# EasyEDA schematic SCH_PHOENIX - PCB-2 .json
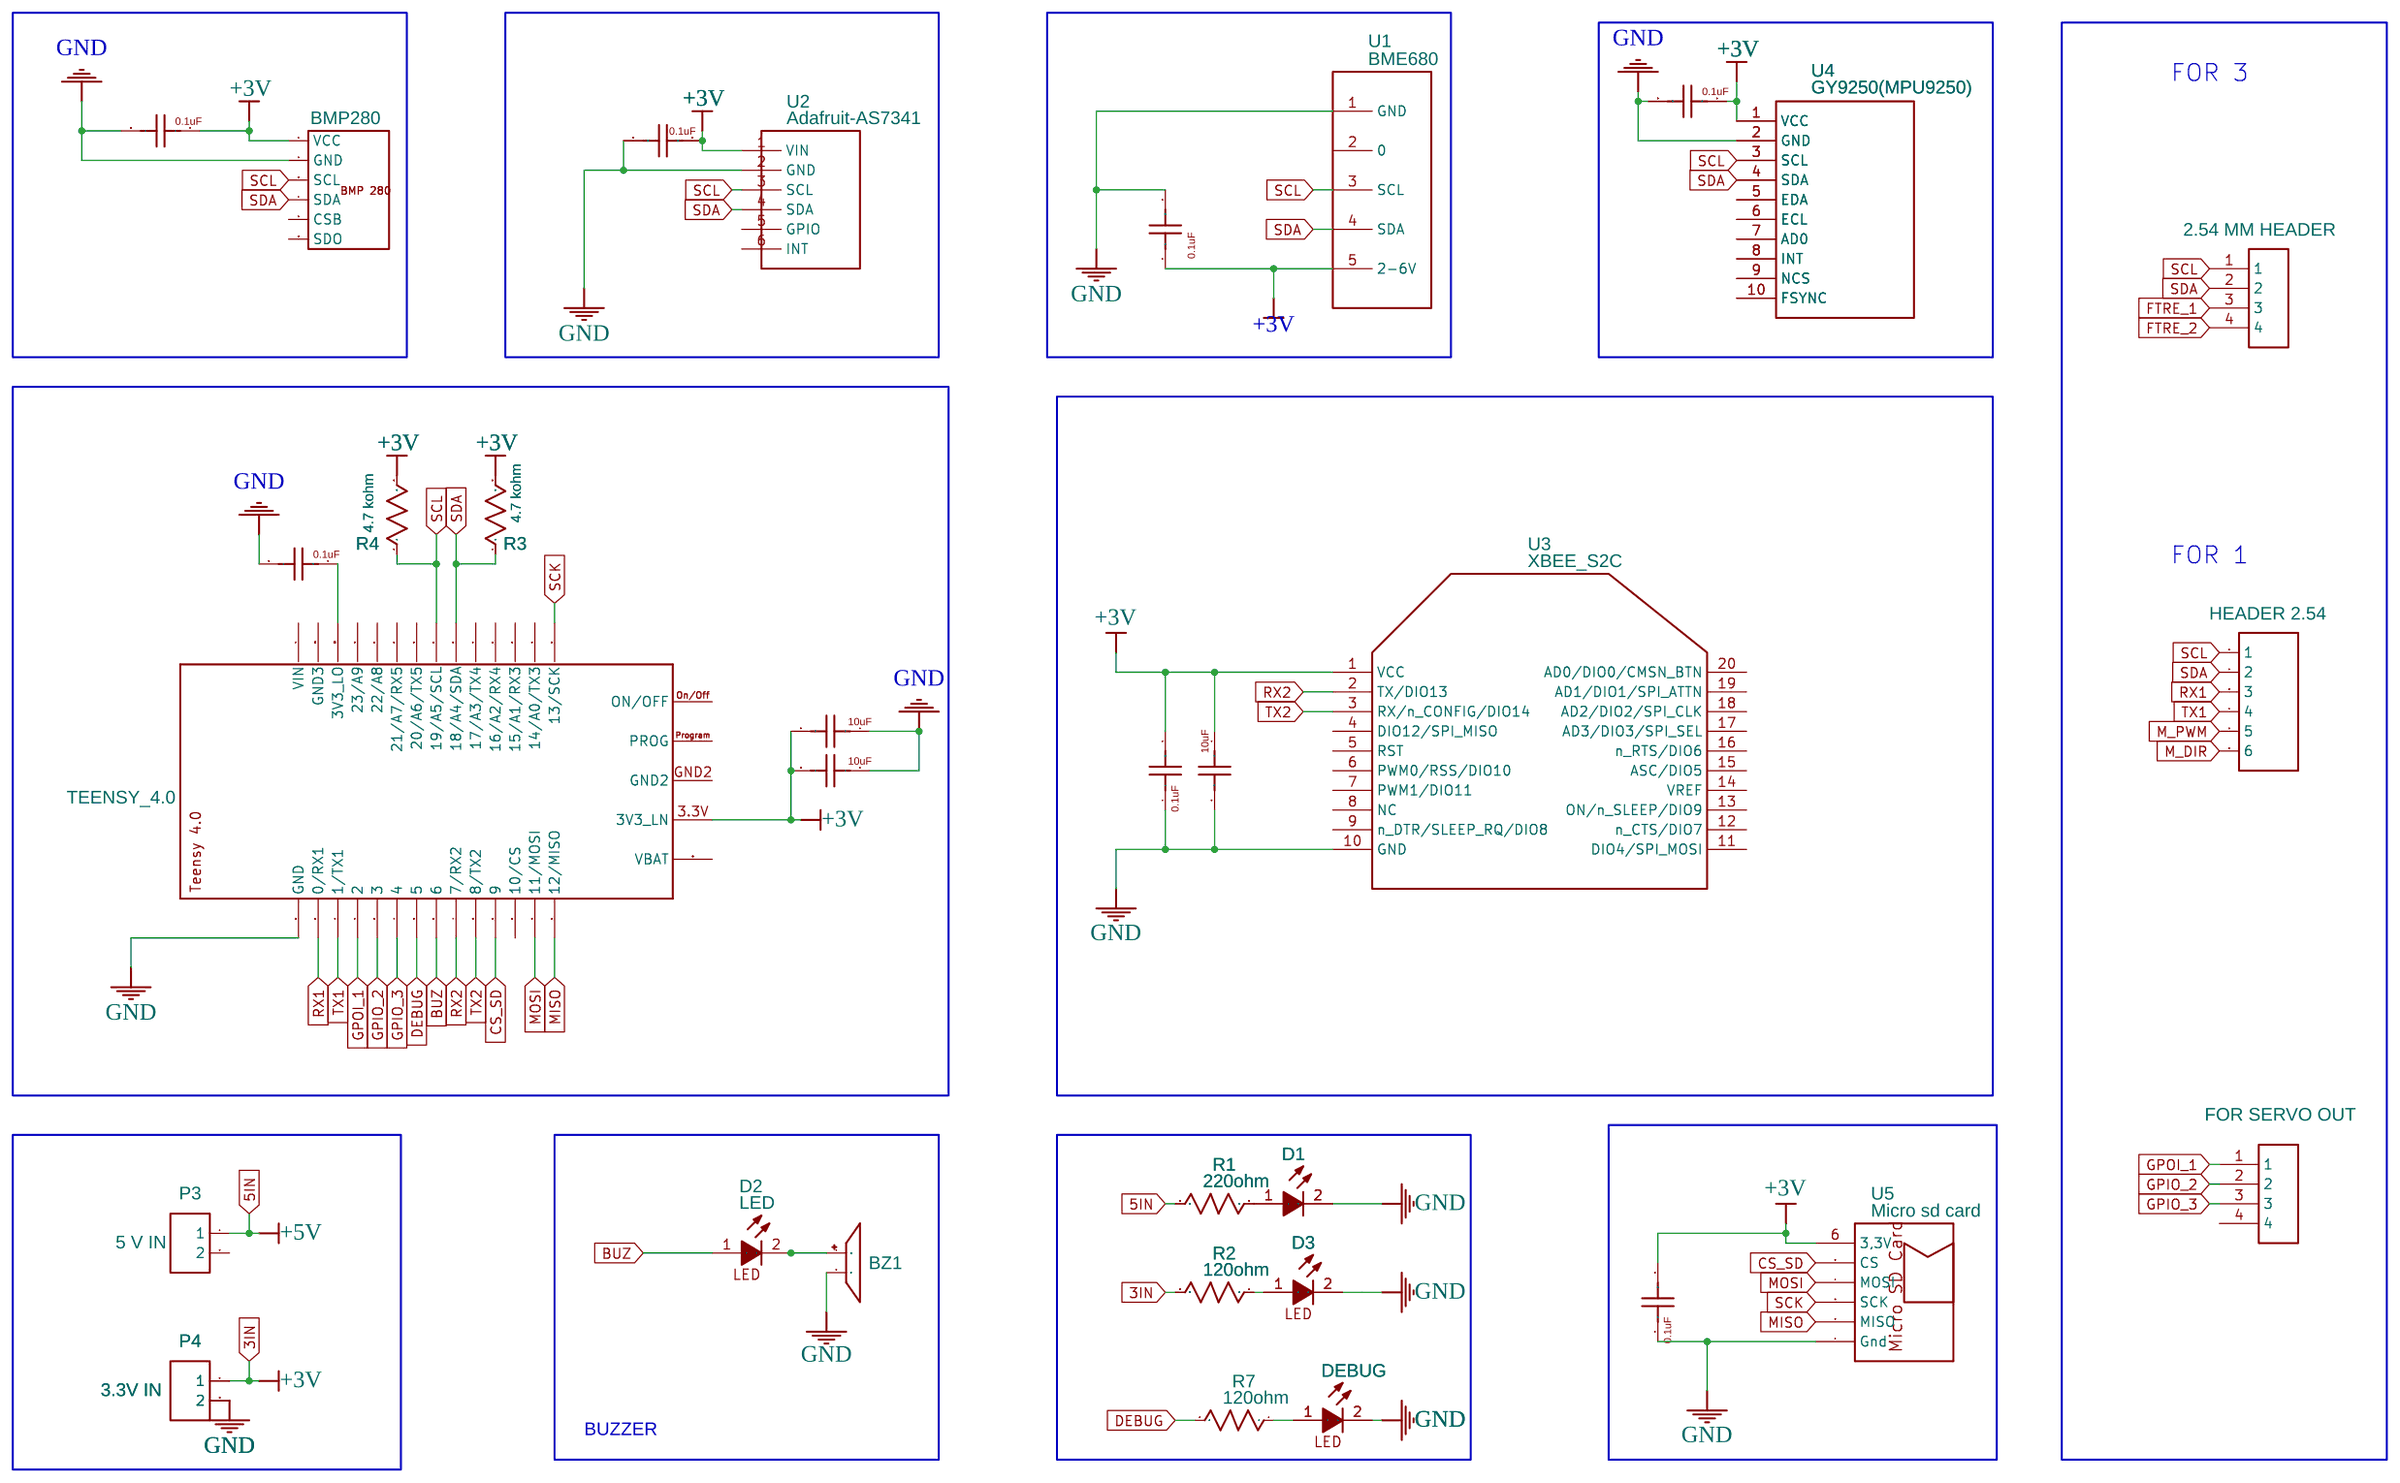
[diagram p0: schematic sheet]

## Parts
0  TEENSY_4.0  [TEENSY40_SMT]
BZ1  Buzzer  [BUZZER]
C1  22PF CERAMIC CAPACITOR  [GENCERAMICCAPACITOR]
C2  22PF CERAMIC CAPACITOR  [GENCERAMICCAPACITOR]
C3  22PF CERAMIC CAPACITOR  [GENCERAMICCAPACITOR]
C4  22PF CERAMIC CAPACITOR  [GENCERAMICCAPACITOR]
C5  22PF CERAMIC CAPACITOR  [GENCERAMICCAPACITOR]
C6  22PF CERAMIC CAPACITOR  [GENCERAMICCAPACITOR]
C7  22PF CERAMIC CAPACITOR  [GENCERAMICCAPACITOR]
C8  22PF CERAMIC CAPACITOR  [GENCERAMICCAPACITOR]
C9  22PF CERAMIC CAPACITOR  [GENCERAMICCAPACITOR]
C10  22PF CERAMIC CAPACITOR  [GENCERAMICCAPACITOR]
D1  LED  [LED-TH_LED-DP2-2LED-AMCC]
D2  LED  [LED-TH_LED-DP2-2LED-AMCC]
D3  LED  [LED-TH_LED-DP2-2LED-AMCC]
DEBUG  LED  [LED-TH_LED-DP2-2LED-AMCC]
H1  2.54 MM HEADER  [B2B 2.54 MM HEADER]
H2  FOR SERVO OUT  [B2B 2.54 MM HEADER]
J1  HEADER 2.54  [HDR-TH_6PIN-V-MALE-PITCH2.54]
MOD1  BMP280  [BMP280 BMP-280]
P3  5 V IN  [CONN-TH_2P-P5.00]
P4  3.3V IN  [CONN-TH_2P-P5.00]
R1  220ohm  [RESISTOR TH]
R2  120ohm  [RESISTOR TH]
R3  4.7 kohm  [RESISTOR TH]
R4  4.7 kohm  [RESISTOR TH]
R7  120ohm  [RESISTOR TH]
U1  BME680  [BME680]
U2  Adafruit-AS7341  [ADAFRUIT-AS7341]
U3  XBEE_S2C  [XBEE_PRO_S2C_THT]
U4  GY9250(MPU9250)  [GY9250(MPU9250)]
U5  Micro sd card  [MICRO SD CARD MODULE W/ SD CARD]

## Library data of the parts
0 = TEENSY_4.0: Contributor: arun2004kumar005; Package Display: No
BZ1 = Buzzer: Contributor: Sub S7v7n; license: https://www.gnu.org/licenses/lgpl-2.1.html
C1-C10 = 22PF CERAMIC CAPACITOR: Contributor: Giann De Leon
D1-D3 DEBUG = LED: Supplier: Digi-Key; Manufacturer: VccLite; Manufacturer Part: 5600; Supplier Part: L20325-ND; link: https://vcclite.com/product/5602f5-5v/; Contributor: brandonmeza
H1 H2 = B2B 2.54 MM HEADER: Manufacturer: MULTICOMP PRO; Manufacturer Part: 2211S-04G; Supplier Part: 1593413; Supplier: Element14; link: https://au.element14.com/multicomp/2211s-03g/header-1-row-vert-3way/dp/1593412?st=2211S-03G; Contributor: alexandriamckie
J1 = HEADER-MALE-2.54_1X6: Manufacturer Part: 2.54mm 1*20PHeader; image: //image.lceda.cn/szlcsc/C50981.jpg; Contributor: Kitchacircuit
MOD1 = BMP280: Supplier: SHIVRAM INDIA; Contributor: bendestras
P3 P4 = CONN-TH_2P-P5.00: Supplier: LCSC; Contributor: LCEDA_Lib
R1-R4 R7 = R_0603_US: Contributor: LCEDA_Lib
U1 = BME680: Contributor: BojanTorbica; Supplier: Pimoroni
U2 = Adafruit-AS7341: Contributor: pierre.jay
U3 = XBEE_S2C: Manufacturer: Digi International; Manufacturer Part: XBP24CZ7PITB003; Supplier: Digi-Key; Supplier Part: 602-1859-ND; link: https://www.digikey.com/product-detail/en/digi-international/XBP24CZ7PITB003/602-1859-ND/5322881?WT.z_cid=ref_neda_dkc_buynow_digiintl&utm_source=ecia&utm_medium=aggregator&utm_campaign=digiintl; Contributor: jorge.caicedo.martinez
U4 = GY9250(MPU9250): Contributor: aequitas
U5 = Micro sd card module: Contributor: Delphin911

## Nets
+3V: 0.3.3V(3V3_LN) C1.2 C2.2 C3.1 C5.2 C6.1 C7.1 C8.1 C9.1 C10.2 MOD1.1(VCC) P4.1 R2.2 R3.2 R4.2 U1.5(2-6V) U2.1(VIN) U3.1(VCC) U4.1(VCC) U5.6(3,3V)
+5V: P3.1 R1.2
GND: 0.GND1(GND) BZ1.2 C1.1 C2.1 C3.2 C4.2 C5.1 C6.2 C7.2 C8.2 C9.2 C10.1 D1.2(K) D3.2(K) DEBUG.2(K) MOD1.2(GND) P4.2 U1.1(GND) U2.2(GND) U3.10(GND) U4.2(GND) U5.1(Gnd)
BUZ: 0.6 D2.1(A)
CS_SD: 0.9 U5.5(CS)
DEBUG: 0.5 R7.2
FTRE_1: H1.3
FTRE_2: H1.4
GPIO_2: 0.3 H2.2
GPIO_3: 0.4 H2.3
GPOI_1: 0.2 H2.1
M_DIR: J1.6
M_PWM: J1.5
MISO: 0.12(12/MISO) U5.2(MISO)
MOSI: 0.11(11/MOSI) U5.4(MOSI)
RX1: 0.0(0/RX1) J1.3
RX2: 0.7(7/RX2) U3.2(TX/DIO13)
SCK: 0.13(13/SCK) U5.3(SCK)
SCL: 0.19(19/A5/SCL) H1.1 J1.1 MOD1.3(SCL) R4.1 U1.3(SCL) U2.3(SCL) U4.3(SCL)
SDA: 0.18(18/A4/SDA) H1.2 J1.2 MOD1.4(SDA) R3.1 U1.4(SDA) U2.4(SDA) U4.4(SDA)
TX1: 0.1(1/TX1) J1.4
TX2: 0.8(8/TX2) U3.3(RX/n_CONFIG/DIO14)
Net-(0-3.3V/250): 0.3.3V/250(3V3_LO) C4.1
Net-(BZ1-1): BZ1.1(Buzzer) D2.2(K)
Net-(D1-1): D1.1(A) R1.1
Net-(D3-1): D3.1(A) R2.1
Net-(DEBUG-1): DEBUG.1(A) R7.1

Not connected (* = marked no-connect by the designer): 0 10(10/CS) 14(14/A0/TX3) 15(15/A1/RX3) 16(16/A2/RX4) 17(17/A3/TX4) 20(20/A6/TX5) 21(21/A7/RX5) 22(22/A8) 23(23/A9) GND2 GND3 On/Off(ON/OFF) Program(PROG) VBat(VBAT) VIN; H2 4; MOD1 5(CSB) 6(SDO); P3 2; U1 2(0); U2 5(GPIO) 6(INT); U3 4(DIO12/SPI_MISO) 5(RST) 6(PWM0/RSS/DIO10) 7(PWM1/DIO11) 8(NC) 9(n_DTR/SLEEP_RQ/DIO8) 11(DIO4/SPI_MOSI) 12(n_CTS/DIO7) 13(ON/n_SLEEP/DIO9) 14(VREF) 15(ASC/DIO5) 16(n_RTS/DIO6) 17(AD3/DIO3/SPI_SEL) 18(AD2/DIO2/SPI_CLK) 19(AD1/DIO1/SPI_ATTN) 20(AD0/DIO0/CMSN_BTN); U4 5(EDA) 6(ECL) 7(AD0) 8(INT) 9(NCS) 10(FSYNC)

## Notes on the sheet
- FOR 3
- FOR 1
- BUZZER
